# Altium schematic sheet Sheet1.SchDoc
size A4
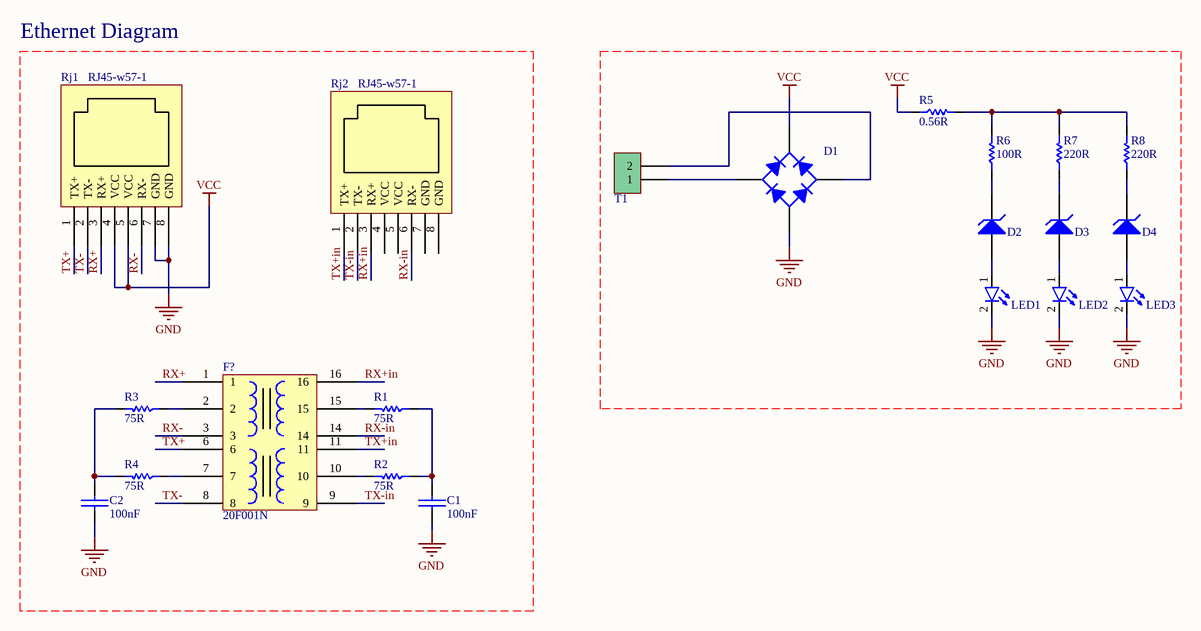
[diagram p0: Sheet1.SchDoc]

## Parts
C1  100nF  [Cap - 100nF]
C2  100nF  [Cap - 100nF]
D1  Diode Bridge  [Bridge]  (value not drawn)
D2  Diode Zener  [Diode 1W]  (value not drawn)
D3  Diode Zener  [Diode 1W]  (value not drawn)
D4  Diode Zener  [Diode 1W]  (value not drawn)
F?  20F001N  [20F001N-YCl]
LED1  Red  [LED-5mm]  (value not drawn)
LED2  Red  [LED-5mm]  (value not drawn)
LED3  Red  [LED-5mm]  (value not drawn)
R1  75R  [RES 1206 (3216X08L)]
R2  75R  [RES 1206 (3216X08L)]
R3  75R  [RES 1206 (3216X08L)]
R4  75R  [RES 1206 (3216X08L)]
R5  0.56R  [Res-(1/1)]
R6  100R  [Res-(1/1)]
R7  220R  [Res-(1/1)]
R8  220R  [Res-(1/1)]
Rj1  RJ45-w57-1  [rj45-w57-1]
Rj2  RJ45-w57-1  [rj45-w57-1]
T1  Phoenix terminal  [phoenix terminal 2]  (value not drawn)

## Nets
GND: C1.2(-) C2.2(-) D1.3(A) LED1.2(K) LED2.2(K) LED3.2(K) Rj1.7(GND) Rj1.8(GND)
VCC: D1.1(K) R5.1 Rj1.4(VCC) Rj1.5(VCC)
RX+: F?.1 Rj1.3(RX+)
RX+in: F?.16 Rj2.3(RX+)
RX-: F?.3 Rj1.6(RX-)
RX-in: F?.14 Rj2.6(RX-)
TX+: F?.6 Rj1.1(TX+)
TX+in: F?.11 Rj2.1(TX+)
TX-: F?.8 Rj1.2(TX-)
TX-in: F?.9 Rj2.2(TX-)
NetC1_1: C1.1(+) R1.1 R2.1
NetC2_1: C2.1(+) R3.2 R4.2
NetD1_2: D1.2(C) T1.2
NetD1_4: D1.4(C) T1.1
NetD2_1: D2.1(A) LED1.1(A)
NetD2_2: D2.2(K) R6.1
NetD3_1: D3.1(A) LED2.1(A)
NetD3_2: D3.2(K) R7.1
NetD4_1: D4.1(A) LED3.1(A)
NetD4_2: D4.2(K) R8.1
NetF?_2: F?.2 R3.1
NetF?_7: F?.7 R4.1
NetF?_10: F?.10 R2.2
NetF?_15: F?.15 R1.2
NetR5_2: R5.2 R6.2 R7.2 R8.2

Not connected (* = marked no-connect by the designer): Rj2 4(VCC) 5(VCC) 7(GND) 8(GND)

## Notes on the sheet
- Ethernet Diagram

## Library data of the parts
C1 C2 = Cap-Bipolar: Bipolar Capacitor; Voltage: 100V; Designer: Saeid Jorablo; Organazation: ControTec; Adding Date: 1387/12/20; Value: 100nF
D1 = Diode Bridge: Full Wave Diode Bridge; Company: E.P.I.L; Design Date: 2011/11/02
D2 = Diode Zener: Zener Diode; Designer: Saeid Jorablo; Company: E.P.I.L; Voltage: 10V; Design Date: 2011/11/02
D3 = Diode Zener: Zener Diode; Designer: Saeid Jorablo; Company: E.P.I.L; Voltage: 20V; Design Date: 2011/11/02
D4 = Diode Zener: Zener Diode; Designer: Saeid Jorablo; Company: E.P.I.L; Voltage: 36V; Design Date: 2011/11/02
F? = 20F001N-YCL
LED1-LED3 = LED: Designer: Saeid Jorablo; Organazation: ControTec; Adding Date: 1387/12/22; Color: Red; Size: SMD 1206
R1-R8 = Resistor: Tolerance: 5%; Power: 1/8 W
  R1-R4: Value: 75R
  R5: Value: 0.56R
  R6: Value: 100R
  R7 R8: Value: 220R
T1 = Phoenix terminal 2: Terminal 2 Pin; Designer: Seyed Mohsen Ghasemain; E-mail: picpars@gmail.com; ComponentLinkURL: www.picpars.com